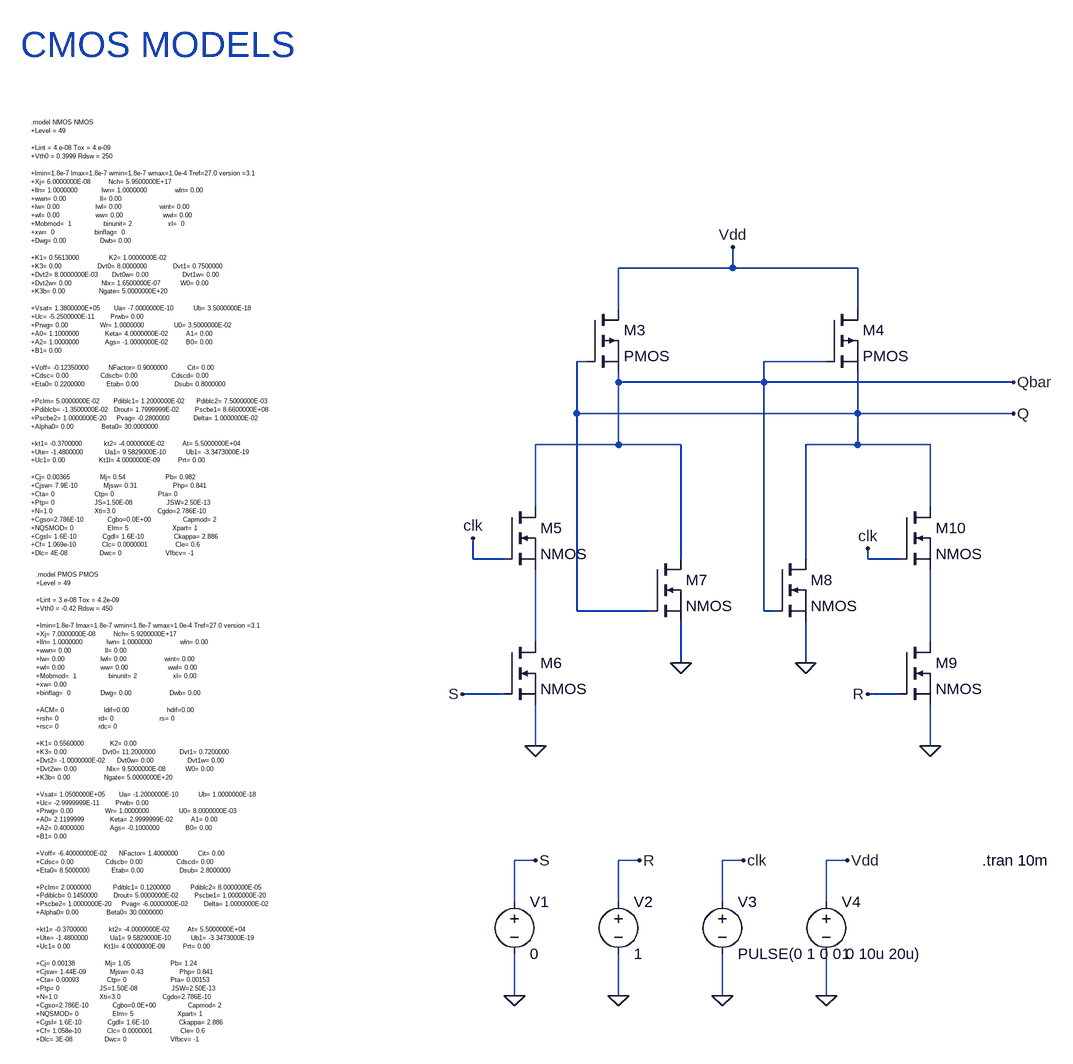
[diagram p0: schematic SR_FF.asc]
SR_FF.asc, the LTspice schematic file:
Version 4
SHEET 1 1100 820
WIRE 592 -320 592 -352
WIRE 592 -320 416 -320
WIRE 784 -320 592 -320
WIRE 416 -256 416 -320
WIRE 784 -256 784 -320
WIRE 368 -176 352 -176
WIRE 736 -176 640 -176
WIRE 416 -144 416 -160
WIRE 640 -144 640 -176
WIRE 640 -144 416 -144
WIRE 1024 -144 640 -144
WIRE 352 -96 352 -176
WIRE 784 -96 784 -160
WIRE 784 -96 352 -96
WIRE 1024 -96 784 -96
WIRE 416 -48 416 -144
WIRE 416 -48 288 -48
WIRE 512 -48 416 -48
WIRE 784 -48 784 -96
WIRE 784 -48 704 -48
WIRE 896 -48 784 -48
WIRE 288 48 288 -48
WIRE 896 48 896 -48
WIRE 192 128 192 96
WIRE 240 128 192 128
WIRE 512 128 512 -48
WIRE 704 128 704 -48
WIRE 800 128 800 112
WIRE 848 128 800 128
WIRE 352 208 352 -96
WIRE 464 208 352 208
WIRE 640 208 640 -144
WIRE 656 208 640 208
WIRE 288 256 288 144
WIRE 896 256 896 144
WIRE 512 288 512 224
WIRE 704 288 704 224
WIRE 240 336 176 336
WIRE 848 336 800 336
WIRE 288 416 288 352
WIRE 896 416 896 352
WIRE 288 592 256 592
WIRE 448 592 416 592
WIRE 608 592 576 592
WIRE 768 592 736 592
WIRE 256 656 256 592
WIRE 416 656 416 592
WIRE 576 656 576 592
WIRE 736 656 736 592
WIRE 256 800 256 736
WIRE 416 800 416 736
WIRE 576 800 576 736
WIRE 736 800 736 736
FLAG 288 416 0
FLAG 896 416 0
FLAG 512 288 0
FLAG 704 288 0
FLAG 592 -352 Vdd
FLAG 176 336 S
FLAG 800 336 R
FLAG 192 96 clk
FLAG 800 112 clk
FLAG 1024 -96 Q
FLAG 1024 -144 Qbar
FLAG 736 800 0
FLAG 576 800 0
FLAG 416 800 0
FLAG 256 800 0
FLAG 288 592 S
FLAG 448 592 R
FLAG 608 592 clk
FLAG 768 592 Vdd
SYMBOL pmos 368 -256 R0
SYMATTR InstName M3
SYMBOL pmos 736 -256 R0
SYMATTR InstName M4
SYMBOL nmos 240 48 R0
SYMATTR InstName M5
SYMBOL nmos 240 256 R0
SYMATTR InstName M6
SYMBOL nmos 464 128 R0
SYMATTR InstName M7
SYMBOL nmos 656 128 R0
SYMATTR InstName M8
SYMBOL nmos 848 256 R0
SYMATTR InstName M9
SYMBOL nmos 848 48 R0
SYMATTR InstName M10
SYMBOL voltage 256 640 R0
SYMATTR InstName V1
SYMATTR Value 0
SYMBOL voltage 416 640 R0
SYMATTR InstName V2
SYMATTR Value 1
SYMBOL voltage 576 640 R0
WINDOW 123 0 0 Left 0
WINDOW 39 0 0 Left 0
SYMATTR InstName V3
SYMATTR Value PULSE(0 1 0 0 0 10u 20u)
SYMBOL voltage 736 640 R0
SYMATTR InstName V4
SYMATTR Value 1
TEXT -488 -544 Left 0 !.model NMOS NMOS\n+Level = 49\n \n+Lint = 4.e-08 Tox = 4.e-09 \n+Vth0 = 0.3999 Rdsw = 250 \n \n+lmin=1.8e-7 lmax=1.8e-7 wmin=1.8e-7 wmax=1.0e-4 Tref=27.0 version =3.1\n+Xj= 6.0000000E-08         Nch= 5.9500000E+17 \n+lln= 1.0000000            lwn= 1.0000000              wln= 0.00\n+wwn= 0.00                 ll= 0.00\n+lw= 0.00                  lwl= 0.00                   wint= 0.00\n+wl= 0.00                  ww= 0.00                    wwl= 0.00\n+Mobmod=  1                binunit= 2                  xl=  0\n+xw=  0                    binflag=  0\n+Dwg= 0.00                 Dwb= 0.00 \n \n+K1= 0.5613000               K2= 1.0000000E-02 \n+K3= 0.00                  Dvt0= 8.0000000             Dvt1= 0.7500000 \n+Dvt2= 8.0000000E-03       Dvt0w= 0.00                 Dvt1w= 0.00 \n+Dvt2w= 0.00               Nlx= 1.6500000E-07          W0= 0.00 \n+K3b= 0.00                 Ngate= 5.0000000E+20 \n \n+Vsat= 1.3800000E+05       Ua= -7.0000000E-10          Ub= 3.5000000E-18 \n+Uc= -5.2500000E-11        Prwb= 0.00 \n+Prwg= 0.00                Wr= 1.0000000               U0= 3.5000000E-02 \n+A0= 1.1000000             Keta= 4.0000000E-02         A1= 0.00 \n+A2= 1.0000000             Ags= -1.0000000E-02         B0= 0.00 \n+B1= 0.00 \n \n+Voff= -0.12350000          NFactor= 0.9000000          Cit= 0.00 \n+Cdsc= 0.00                Cdscb= 0.00                 Cdscd= 0.00 \n+Eta0= 0.2200000           Etab= 0.00                  Dsub= 0.8000000 \n \n+Pclm= 5.0000000E-02       Pdiblc1= 1.2000000E-02      Pdiblc2= 7.5000000E-03 \n+Pdiblcb= -1.3500000E-02   Drout= 1.7999999E-02        Pscbe1= 8.6600000E+08 \n+Pscbe2= 1.0000000E-20     Pvag= -0.2800000            Delta= 1.0000000E-02 \n+Alpha0= 0.00              Beta0= 30.0000000 \n \n+kt1= -0.3700000           kt2= -4.0000000E-02         At= 5.5000000E+04 \n+Ute= -1.4800000           Ua1= 9.5829000E-10          Ub1= -3.3473000E-19 \n+Uc1= 0.00                 Kt1l= 4.0000000E-09         Prt= 0.00 \n \n+Cj= 0.00365               Mj= 0.54                    Pb= 0.982\n+Cjsw= 7.9E-10             Mjsw= 0.31                  Php= 0.841\n+Cta= 0                    Ctp= 0                      Pta= 0\n+Ptp= 0                    JS=1.50E-08                 JSW=2.50E-13\n+N=1.0                     Xti=3.0                     Cgdo=2.786E-10\n+Cgso=2.786E-10            Cgbo=0.0E+00                Capmod= 2\n+NQSMOD= 0                 Elm= 5                      Xpart= 1\n+Cgsl= 1.6E-10             Cgdl= 1.6E-10               Ckappa= 2.886\n+Cf= 1.069e-10             Clc= 0.0000001              Cle= 0.6\n+Dlc= 4E-08                Dwc= 0                      Vfbcv= -1
TEXT -480 152 Left 0 !.model PMOS PMOS\n+Level = 49\n \n+Lint = 3.e-08 Tox = 4.2e-09 \n+Vth0 = -0.42 Rdsw = 450 \n \n+lmin=1.8e-7 lmax=1.8e-7 wmin=1.8e-7 wmax=1.0e-4 Tref=27.0 version =3.1\n+Xj= 7.0000000E-08         Nch= 5.9200000E+17 \n+lln= 1.0000000            lwn= 1.0000000              wln= 0.00\n+wwn= 0.00                 ll= 0.00\n+lw= 0.00                  lwl= 0.00                   wint= 0.00\n+wl= 0.00                  ww= 0.00                    wwl= 0.00\n+Mobmod=  1                binunit= 2                  xl= 0.00\n+xw= 0.00                  \n+binflag=  0               Dwg= 0.00                   Dwb= 0.00 \n \n+ACM= 0                    ldif=0.00                   hdif=0.00\n+rsh= 0                    rd= 0                       rs= 0\n+rsc= 0                    rdc= 0\n \n+K1= 0.5560000             K2= 0.00 \n+K3= 0.00                  Dvt0= 11.2000000            Dvt1= 0.7200000 \n+Dvt2= -1.0000000E-02      Dvt0w= 0.00                 Dvt1w= 0.00 \n+Dvt2w= 0.00               Nlx= 9.5000000E-08          W0= 0.00 \n+K3b= 0.00                 Ngate= 5.0000000E+20 \n \n+Vsat= 1.0500000E+05       Ua= -1.2000000E-10          Ub= 1.0000000E-18 \n+Uc= -2.9999999E-11        Prwb= 0.00 \n+Prwg= 0.00                Wr= 1.0000000               U0= 8.0000000E-03 \n+A0= 2.1199999             Keta= 2.9999999E-02         A1= 0.00 \n+A2= 0.4000000             Ags= -0.1000000             B0= 0.00 \n+B1= 0.00 \n \n+Voff= -6.40000000E-02      NFactor= 1.4000000          Cit= 0.00 \n+Cdsc= 0.00                Cdscb= 0.00                 Cdscd= 0.00 \n+Eta0= 8.5000000           Etab= 0.00                  Dsub= 2.8000000 \n \n+Pclm= 2.0000000           Pdiblc1= 0.1200000          Pdiblc2= 8.0000000E-05 \n+Pdiblcb= 0.1450000        Drout= 5.0000000E-02        Pscbe1= 1.0000000E-20 \n+Pscbe2= 1.0000000E-20     Pvag= -6.0000000E-02        Delta= 1.0000000E-02 \n+Alpha0= 0.00              Beta0= 30.0000000 \n \n+kt1= -0.3700000           kt2= -4.0000000E-02         At= 5.5000000E+04 \n+Ute= -1.4800000           Ua1= 9.5829000E-10          Ub1= -3.3473000E-19 \n+Uc1= 0.00                 Kt1l= 4.0000000E-09         Prt= 0.00 \n \n+Cj= 0.00138               Mj= 1.05                    Pb= 1.24\n+Cjsw= 1.44E-09            Mjsw= 0.43                  Php= 0.841\n+Cta= 0.00093              Ctp= 0                      Pta= 0.00153\n+Ptp= 0                    JS=1.50E-08                 JSW=2.50E-13\n+N=1.0                     Xti=3.0                     Cgdo=2.786E-10\n+Cgso=2.786E-10            Cgbo=0.0E+00                Capmod= 2\n+NQSMOD= 0                 Elm= 5                      Xpart= 1\n+Cgsl= 1.6E-10             Cgdl= 1.6E-10               Ckappa= 2.886\n+Cf= 1.058e-10             Clc= 0.0000001              Cle= 0.6\n+Dlc= 3E-08                Dwc= 0                      Vfbcv= -1
TEXT -504 -664 Left 5 ;CMOS MODELS
TEXT 976 592 Left 2 !.tran 10m

The netlist it stands for:
* SR_FF.asc
M3 Vdd Q Qbar Qbar PMOS
M4 Vdd Qbar Q Q PMOS
M5 Qbar clk N001 N001 NMOS
M6 N001 S 0 0 NMOS
M7 Qbar Q 0 0 NMOS
M8 Q Qbar 0 0 NMOS
M9 N002 R 0 0 NMOS
M10 Q clk N002 N002 NMOS
V1 S 0 0
V2 R 0 1
V3 clk 0 PULSE(0 1 0 0 0 10u 20u)
V4 Vdd 0 1
.model NMOS NMOS
.model PMOS PMOS
.lib standard.mos
.model NMOS NMOS
+Level = 49
+Lint = 4.e-08 Tox = 4.e-09
+Vth0 = 0.3999 Rdsw = 250
+lmin=1.8e-7 lmax=1.8e-7 wmin=1.8e-7 wmax=1.0e-4 Tref=27.0 version =3.1
+Xj= 6.0000000E-08         Nch= 5.9500000E+17
+lln= 1.0000000            lwn= 1.0000000              wln= 0.00
+wwn= 0.00                 ll= 0.00
+lw= 0.00                  lwl= 0.00                   wint= 0.00
+wl= 0.00                  ww= 0.00                    wwl= 0.00
+Mobmod=  1                binunit= 2                  xl=  0
+xw=  0                    binflag=  0
+Dwg= 0.00                 Dwb= 0.00
+K1= 0.5613000               K2= 1.0000000E-02
+K3= 0.00                  Dvt0= 8.0000000             Dvt1= 0.7500000
+Dvt2= 8.0000000E-03       Dvt0w= 0.00                 Dvt1w= 0.00
+Dvt2w= 0.00               Nlx= 1.6500000E-07          W0= 0.00
+K3b= 0.00                 Ngate= 5.0000000E+20
+Vsat= 1.3800000E+05       Ua= -7.0000000E-10          Ub= 3.5000000E-18
+Uc= -5.2500000E-11        Prwb= 0.00
+Prwg= 0.00                Wr= 1.0000000               U0= 3.5000000E-02
+A0= 1.1000000             Keta= 4.0000000E-02         A1= 0.00
+A2= 1.0000000             Ags= -1.0000000E-02         B0= 0.00
+B1= 0.00
+Voff= -0.12350000          NFactor= 0.9000000          Cit= 0.00
+Cdsc= 0.00                Cdscb= 0.00                 Cdscd= 0.00
+Eta0= 0.2200000           Etab= 0.00                  Dsub= 0.8000000
+Pclm= 5.0000000E-02       Pdiblc1= 1.2000000E-02      Pdiblc2= 7.5000000E-03
+Pdiblcb= -1.3500000E-02   Drout= 1.7999999E-02        Pscbe1= 8.6600000E+08
+Pscbe2= 1.0000000E-20     Pvag= -0.2800000            Delta= 1.0000000E-02
+Alpha0= 0.00              Beta0= 30.0000000
+kt1= -0.3700000           kt2= -4.0000000E-02         At= 5.5000000E+04
+Ute= -1.4800000           Ua1= 9.5829000E-10          Ub1= -3.3473000E-19
+Uc1= 0.00                 Kt1l= 4.0000000E-09         Prt= 0.00
+Cj= 0.00365               Mj= 0.54                    Pb= 0.982
+Cjsw= 7.9E-10             Mjsw= 0.31                  Php= 0.841
+Cta= 0                    Ctp= 0                      Pta= 0
+Ptp= 0                    JS=1.50E-08                 JSW=2.50E-13
+N=1.0                     Xti=3.0                     Cgdo=2.786E-10
+Cgso=2.786E-10            Cgbo=0.0E+00                Capmod= 2
+NQSMOD= 0                 Elm= 5                      Xpart= 1
+Cgsl= 1.6E-10             Cgdl= 1.6E-10               Ckappa= 2.886
+Cf= 1.069e-10             Clc= 0.0000001              Cle= 0.6
+Dlc= 4E-08                Dwc= 0                      Vfbcv= -1
.model PMOS PMOS
+Level = 49
+Lint = 3.e-08 Tox = 4.2e-09
+Vth0 = -0.42 Rdsw = 450
+lmin=1.8e-7 lmax=1.8e-7 wmin=1.8e-7 wmax=1.0e-4 Tref=27.0 version =3.1
+Xj= 7.0000000E-08         Nch= 5.9200000E+17
+lln= 1.0000000            lwn= 1.0000000              wln= 0.00
+wwn= 0.00                 ll= 0.00
+lw= 0.00                  lwl= 0.00                   wint= 0.00
+wl= 0.00                  ww= 0.00                    wwl= 0.00
+Mobmod=  1                binunit= 2                  xl= 0.00
+xw= 0.00
+binflag=  0               Dwg= 0.00                   Dwb= 0.00
+ACM= 0                    ldif=0.00                   hdif=0.00
+rsh= 0                    rd= 0                       rs= 0
+rsc= 0                    rdc= 0
+K1= 0.5560000             K2= 0.00
+K3= 0.00                  Dvt0= 11.2000000            Dvt1= 0.7200000
+Dvt2= -1.0000000E-02      Dvt0w= 0.00                 Dvt1w= 0.00
+Dvt2w= 0.00               Nlx= 9.5000000E-08          W0= 0.00
+K3b= 0.00                 Ngate= 5.0000000E+20
+Vsat= 1.0500000E+05       Ua= -1.2000000E-10          Ub= 1.0000000E-18
+Uc= -2.9999999E-11        Prwb= 0.00
+Prwg= 0.00                Wr= 1.0000000               U0= 8.0000000E-03
+A0= 2.1199999             Keta= 2.9999999E-02         A1= 0.00
+A2= 0.4000000             Ags= -0.1000000             B0= 0.00
+B1= 0.00
+Voff= -6.40000000E-02      NFactor= 1.4000000          Cit= 0.00
+Cdsc= 0.00                Cdscb= 0.00                 Cdscd= 0.00
+Eta0= 8.5000000           Etab= 0.00                  Dsub= 2.8000000
+Pclm= 2.0000000           Pdiblc1= 0.1200000          Pdiblc2= 8.0000000E-05
+Pdiblcb= 0.1450000        Drout= 5.0000000E-02        Pscbe1= 1.0000000E-20
+Pscbe2= 1.0000000E-20     Pvag= -6.0000000E-02        Delta= 1.0000000E-02
+Alpha0= 0.00              Beta0= 30.0000000
+kt1= -0.3700000           kt2= -4.0000000E-02         At= 5.5000000E+04
+Ute= -1.4800000           Ua1= 9.5829000E-10          Ub1= -3.3473000E-19
+Uc1= 0.00                 Kt1l= 4.0000000E-09         Prt= 0.00
+Cj= 0.00138               Mj= 1.05                    Pb= 1.24
+Cjsw= 1.44E-09            Mjsw= 0.43                  Php= 0.841
+Cta= 0.00093              Ctp= 0                      Pta= 0.00153
+Ptp= 0                    JS=1.50E-08                 JSW=2.50E-13
+N=1.0                     Xti=3.0                     Cgdo=2.786E-10
+Cgso=2.786E-10            Cgbo=0.0E+00                Capmod= 2
+NQSMOD= 0                 Elm= 5                      Xpart= 1
+Cgsl= 1.6E-10             Cgdl= 1.6E-10               Ckappa= 2.886
+Cf= 1.058e-10             Clc= 0.0000001              Cle= 0.6
+Dlc= 3E-08                Dwc= 0                      Vfbcv= -1
* CMOS MODELS
.tran 10m
.backanno
.end